# Altium schematic sheet chipjabber-bbi-probe.SchDoc: <Enter Sheet Title>
size Letter; Organization: NewAE Technology Inc.; Address1: 1083 Queen St., Suite 196; Address2: Halifax; Address3: NS; Address4: Canada B3H 0B2; SheetApproved: NO
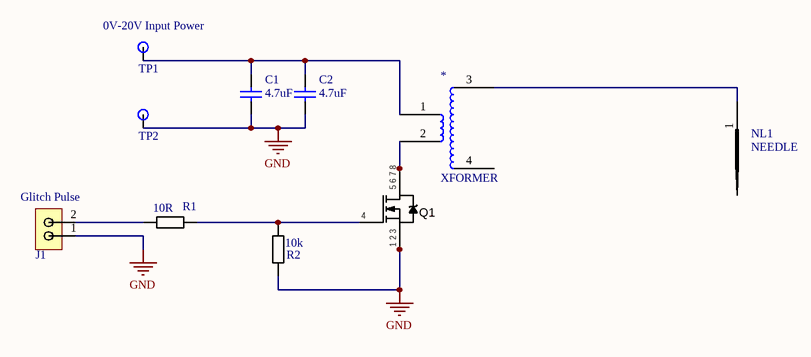
[diagram p0: chipjabber-bbi-probe.SchDoc]

## Parts
*  XFORMER  [XFORMER]
C1  4.7uF  [CAPC0805_M]
C2  4.7uF  [CAPC0805_M]
J1  Power_Header  [76382-302LF]  (value not drawn)
NL1  NEEDLE  [PIN]
Q1  IRF7807ZTRPBF  [SOIC8_NARROW]  (value not drawn)
R1  10R  [RESC1608X55N]
R2  10k  [RESC1608X55N]
TP1  5009  [KEYSTONE5009]  (value not drawn)
TP2  5011  [KEYSTONE5011]  (value not drawn)

## Nets
GND: C1.2 C2.2 J1.1 Q1.1(1,2,3) Q1.2(S) Q1.3(S) R2.2 TP2.1
Net*_1: *.1 C1.1 C2.1 TP1.1
Net*_2: *.2 Q1.5(5,6,7,8) Q1.6(D) Q1.7(D) Q1.8(D)
Net*_3: *.3 NL1.1
NetJ1_2: J1.2 R1.1
NetQ1_4: Q1.4(G) R1.2 R2.1

Not connected (* = marked no-connect by the designer): * 4

## Notes on the sheet
- (near TP1) 0V-20V Input Power
- (near J1) Glitch Pulse
- Title:
- Date:
- Rev:
- Time:
- Project:
- Sheet
- of
- License:
- Copyright © NewAE Technology Inc.
- Approved:
- NewAE.com
- File:

## Library data of the parts
C1 C2 = CCHIP-4u7-0805-50V: 4u7, 50V, 0805, Ceramic; Manufacture 1: TDK Corporation; Manufacture Part Number 1: C2012X5R1H475K125AB; Component Group: Capacitor; Case-EIA: 0805; Case-Metric: 1608; Rated Voltage: 50VDC; Tolerance: 10%; Part Number: CCHIP-4u7-0805-50V; Footprint: 0805; Pin Count: 2; Supplier 1: Digi-Key; Supplier Part Number 1: 445-5980-1-ND; Value: 4.7uF; Mounting Technology: SMT; RoHS: Yes; Temperature Range: -55C to 85C; Component Kind: Standard; Component Type: Standard
J1 = 2_PIN_RIGHT_POWER: CONN HEADER 2POS .100" R/A GOLD; Manufacture 1: Amphenol FCI; Component Group: Connector; PP Material Stack: 0; Part Number: 2_PIN_RIGHT_POWER; Manufacture Part Number 1: 76382-302LF; Pin Count: 2; Supplier 1: Digi-Key; Supplier Part Number 1: 609-1278-ND; Mounting Technology: Through-hole; RoHS: Yes; Component Kind: Standard; Component Type: Standard; PP Rotation: 0
Q1 = IRF7807ZTRPBF: MOSFET, N-Channel, 8-SOIC, Logic Level; Manufacture 1: International Rectifier; Part Number: IRF7807ZTRPBF; Component Group: MOSFET; Footprint: 8-SOIC; Manufacture Part Number 1: IRF7807ZTRPBF; Pin Count: 8; Supplier 1: Digi-Key; Supplier Part Number 1: IRF7807ZPBFCT-ND; Mounting Technology: SMT; Component Kind: Standard; Component Type: Standard
R1 = RCHIP-10R-0603: 10R res, 0603, 1%, 1/10W; Manufacture 1: Yageo; Manufacture Part Number 1: RC0603FR-0710RL; Component Group: Resistor; Case-EIA: 0603; Case-Metric: 1608; Rated Power: 0.1W; Rated Voltage: 75VDC; Part Number: RCHIP-10R-0603; Footprint: 0603; Pin Count: 2; Supplier 1: Digi-Key; Supplier Part Number 1: 311-10.0HRCT-ND; Value: 10R; Tolerance: 1%; Mounting Technology: SMT; Temperature Range: -55C to 155C; Component Kind: Standard; Component Type: Standard
R2 = RCHIP-10K-0603: 10k res, 0603, 1%, 1/10W; Manufacture 1: Yageo; Manufacture Part Number 1: RC0603FR-0710KL; Component Group: Resistor; Case-EIA: 0603; Case-Metric: 1608; Rated Power: 0.1W; Rated Voltage: 75VDC; Part Number: RCHIP-10K-0603; Footprint: 0603; Pin Count: 2; Supplier 1: Digi-Key; Supplier Part Number 1: 311-10.0KHRCT-ND; Value: 10k; Tolerance: 1%; Mounting Technology: SMT; Temperature Range: -55C to 155C; Component Kind: Standard; Component Type: Standard
TP1 = KEYSTONE_5009: TEST POINT PC COMPACT .063"D YEL; Part Number: KEYSTONE_5009; Component Group: Test Point; Pin Count: 1; Supplier 1: Digi-Key; Supplier Part Number 1: 36-5009-ND; Mounting Technology: Through-hole; Component Kind: Standard; Component Type: Standard
TP2 = KEYSTONE_5011: TEST POINT PC MULTI PURPOSE BLK; Part Number: KEYSTONE_5011; Component Group: Test Point; Pin Count: 1; Supplier 1: Digi-Key; Supplier Part Number 1: 36-5011-ND; Mounting Technology: Through-hole; Component Kind: Standard; Component Type: Standard